# Altium schematic sheet POWER.SchDoc
size 420 x 297 mm; DocumentNumber: ЛАЭ3.20.10.02.05.200 Э3; SheetNumber: 4
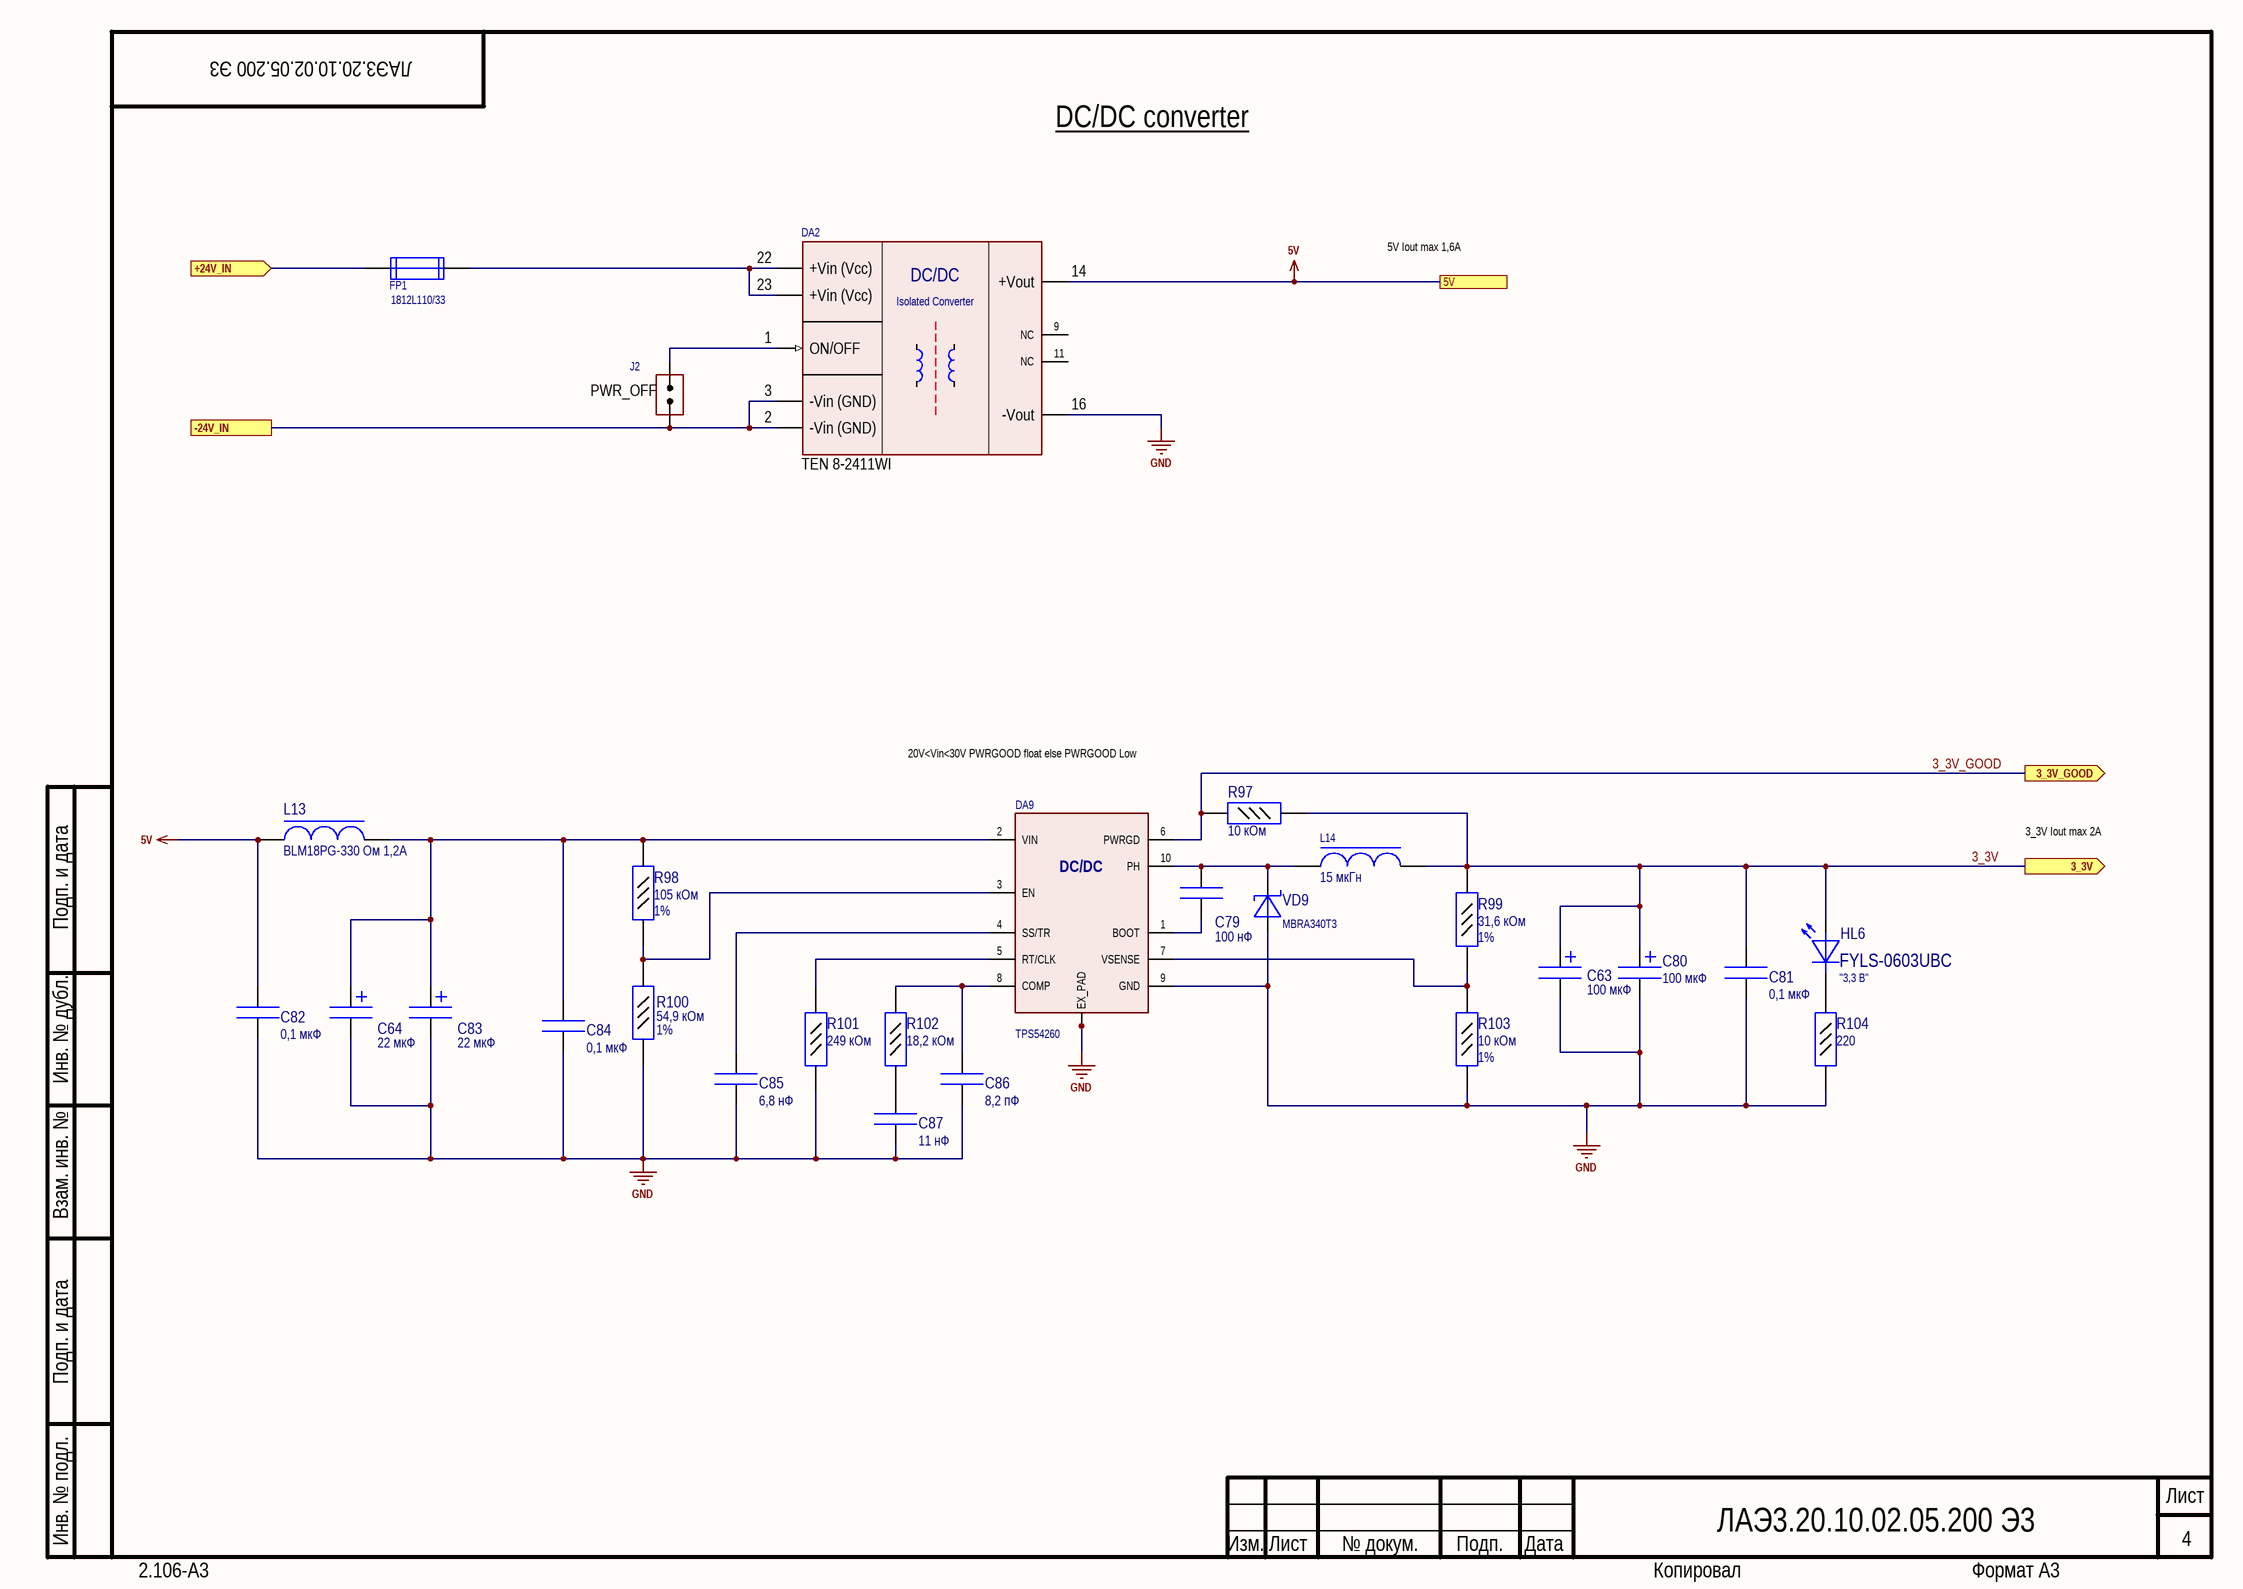
[diagram p0: POWER.SchDoc]

## Parts
C63  value 100 мкФ  [CA-D (6.3x5.4)(0605)]  (hidden comment: CA-16V100 мкФ-±20%-D (0605))
C64  value 22 мкФ  [CT-D]  (hidden comment: CT-35V-22uF-±20%-D)
C79  value 100 нФ  [CC0603]  (hidden comment: CC0603-X7R-100 нФ-20%-50В)
C80  value 100 мкФ  [CA-D (6.3x5.4)(0605)]  (hidden comment: CA-16V100 мкФ-±20%-D (0605))
C81  value 0,1 мкФ  [CC0603]  (hidden comment: CC0603-X7R-0,1 мкФ-20%-50В)
C82  value 0,1 мкФ  [CC0603]  (hidden comment: CC0603-X7R-0,1 мкФ-20%-50В)
C83  value 22 мкФ  [CT-D]  (hidden comment: CT-35V-22uF-±20%-D)
C84  value 0,1 мкФ  [CC0603]  (hidden comment: CC0603-X7R-0,1 мкФ-20%-50В)
C85  value 6,8 нФ  [CC0603]  (hidden comment: CC0603-X7R-6,8 нФ-20%-50В)
C86  value 8,2 пФ  [CC0603]  (hidden comment: CC0603-X7R-8,2 пФ-20%-50В)
C87  value 11 нФ  [CC0603]  (hidden comment: CC0603-X7R-11 нФ-20%-50В)
DA2  TEN 8-2411WI  [TEN_8-2411WI]
DA9  TPS54260  [IC_XTR111AIDGQR]
FP1  1812L110/33  [MF-MSMD010]
HL6  FYLS-0603UBC  Mean: "3,3 В"  [LED0603_Blue]
J2  CommentText: PWR_OFF  [CON: PLS-2]
L13  BLM18PG-330 Ом 1,2A  [CL0603]
L14  value 15 мкГн  [SRR0603]  (hidden comment: SRR0603-150ML)
R97  value 10 кОм  [CR0603]  (hidden comment: CR0603-10 кОм-±5%)
R98  value 105 кОм  TOLERANCE: 1%  [CR0603]  (hidden comment: CR0603-105 кОм-±1%)
R99  value 31,6 кОм  TOLERANCE: 1%  [CR0603]  (hidden comment: CR0603-31,6 кОм-±1%)
R100  value 54,9 кОм  TOLERANCE: 1%  [CR0603]  (hidden comment: CR0603-54,9 кОм-±1%)
R101  value 249 кОм  [CR0603]  (hidden comment: CR0603-249 кОм-±5%)
R102  value 18,2 кОм  [CR0603]  (hidden comment: CR0603-18,2 кОм-±5%)
R103  value 10 кОм  TOLERANCE: 1%  [CR0603]  (hidden comment: CR0603-10 кОм-±1%)
R104  value 220  [CR0603]  (hidden comment: CR0603-220-±5%)
VD9  MBRA340T3  [DO-214AC (SMA)]

## Ports
3_3V (out), 3_3V_GOOD (out), 5V, +24V_IN (in), -24V_IN

## Nets
5V: C82.1(+) DA2.14(+Vout) L13.1 ; port 5V
GND: C63.2(-) C64.2(-) C80.2(-) C81.2(-) C82.2(-) C83.2(-) C84.2(-) C85.2(-) C86.2(-) C87.2(-) DA2.16(-Vout) DA9.9(GND) DA9.11(EX_PAD) DA9.12(EX_PAD) DA9.13(EX_PAD) DA9.14(EX_PAD) DA9.15(EX_PAD) DA9.16(EX_PAD) R100.1(+) R101.1(+) R103.1(+) R104.2(-) VD9.1(+)
3_3V: C63.1(+) C80.1(+) C81.1(+) HL6.1(A) L14.2 R97.1(+) R99.2(-) ; port 3_3V
3_3V_GOOD: DA9.6(PWRGD) R97.2(-) ; port 3_3V_GOOD
+24V_IN: FP1.1(+) ; port +24V_IN
-24V_IN: DA2.2(-Vin_(GND)) DA2.3(-Vin_(GND)) J2.2(IN) ; port -24V_IN
NetC64_1: C64.1(+) C83.1(+) C84.1(+) DA9.2(VIN) L13.2 R98.2(-)
NetC79_1: C79.1(+) DA9.10(PH) L14.1 VD9.2(-)
NetC79_2: C79.2(-) DA9.1(BOOT)
NetC85_1: C85.1(+) DA9.4(SS/TR)
NetC86_1: C86.1(+) DA9.8(COMP) R102.2(-)
NetC87_1: C87.1(+) R102.1(+)
NetDA2_1: DA2.1(ON/OFF) J2.1(IN)
NetDA2_22: DA2.22(+Vin_(Vcc)) DA2.23(+Vin_(Vcc)) FP1.2(-)
NetDA9_3: DA9.3(EN) R98.1(+) R100.2(-)
NetDA9_5: DA9.5(RT/CLK) R101.2(-)
NetDA9_7: DA9.7(VSENSE) R99.1(+) R103.2(-)
NetHL6_2: HL6.2(K) R104.1(+)

Not connected (* = marked no-connect by the designer): DA2 9(NC) 11(NC)

## Notes on the sheet
- DC/DC converter
- 5V Iout max 1,6A
- 20V<Vin<30V PWRGOOD float else PWRGOOD Low
- 3_3V Iout max 2A
- Подп. и дата
- Инв. № дубл.
- Взам. инв. №
- Инв. № подл.
- Изм.
- Лист
- № докум.
- Подп.
- Дата
- 2.106-A3
- Копировал
- Формат А3
- (in symbol TEN 8-2411WI) DC/DC; Isolated Converter
- (in symbol TPS54260DGQ) DC/DC

## Library data of the parts
C63 C80 = CA-16V-#-±20%-D (0605): SMD ELECTROLYTIC CAPACITORS; КОМПЭЛ: CA016M0100RED-0605; Supplier 1: Mouser; Supplier Part Number 1: N/A; Supplier 2: Farnell; Supplier Part Number 2: 2370253
C64 C83 = CT-35V-#-±20%-D: Чип конденсатор  танталовый
C79 C81 C82 C84-C87 = CC0603-X7R-#-20%-50В: Чип конденсатор керамический; Компэл: CC0603KRX7R9BB104; Supplier 1: Newark; Supplier Part Number 1: 65R8251
DA2 = TEN 8-2411WI: 9-36V input, 5V, 1.6 A output, 8 Watt dc/dc converter isolated 1500 VDC; Manufacturer: TRACO POWER; ValueManufacturerPartNumber: DC/DC converter, input 9...36V, 300 kHz, 5 V 1%, 1600 mA, -40...+85°C, metall DIP-24; VoltageInput: input 9...36V; Frequency: 300 kHz; CurrentOutput: 1600 mA; VoltageOutput: 5 V 1%; Package: metall DIP-24; ComponentType: DC/DC converter; Temperature: -40...+85°C; Supplier 1: RSComponents; Supplier Part Number 1: 1247572; Isolation: 1500 VDC; PartNumber: TEN 8-2411WI
DA9 = TPS54260DGQ: 60-V,2.5-A,step-down regulator with an integrated high-side MOSFET; ComponentLink1Description: Datasheet; ComponentLink1URL: https://www.ti.com/lit/ds/symlink/tps54262-ep.pdf?ts=1608308143821&ref_url=https%253A%252F%252Fwww.ti.com%252Fpower-management%252Fnon-isolated-dc-dc-switching-regulators%252Fstep-down-buck%252Fbuck-converter-integrated-switch%252Fproducts.html; Supplier 1: Digi-Key; Supplier Part Number 1: 296-27231-5-ND; _Value: TPS54260
FP1 = MF-MSMD010: сраб. 1,1 А, крит.1,95А
HL6 = FYLS-0603UBC: Светодиод синий SMD0603
J2 = Jumper_single
L13 = BLM18: Чип индуктивность подавления EMP; VALUE: 330 Ом; Imax: 1,2A; Supplier 1: Mouser; Supplier Part Number 1: 81-BLM18PG331SN1D
L14 = SRR0603: Чип индуктивность 15 мкГн, 900 мА, Экранированный, 1.2 А
R97 R101 R102 R104 = CR0603-#-±5%: Чип резистор
R98-R100 R103 = CR0603-#-±1%: Чип резистор; Supplier 1: Farnell; Supplier Part Number 1: 2008332
VD9 = MBRA340T3: Диод шотки I=3А V=40В; PR: ON Semiconductor; Supplier 1: Digi-Key; Supplier Part Number 1: MBRA340T3GOSDKR-ND